# EAGLE board UCirKitBreadboardTop-08231908 (EAGLE 6.5.0), part 1 of 2
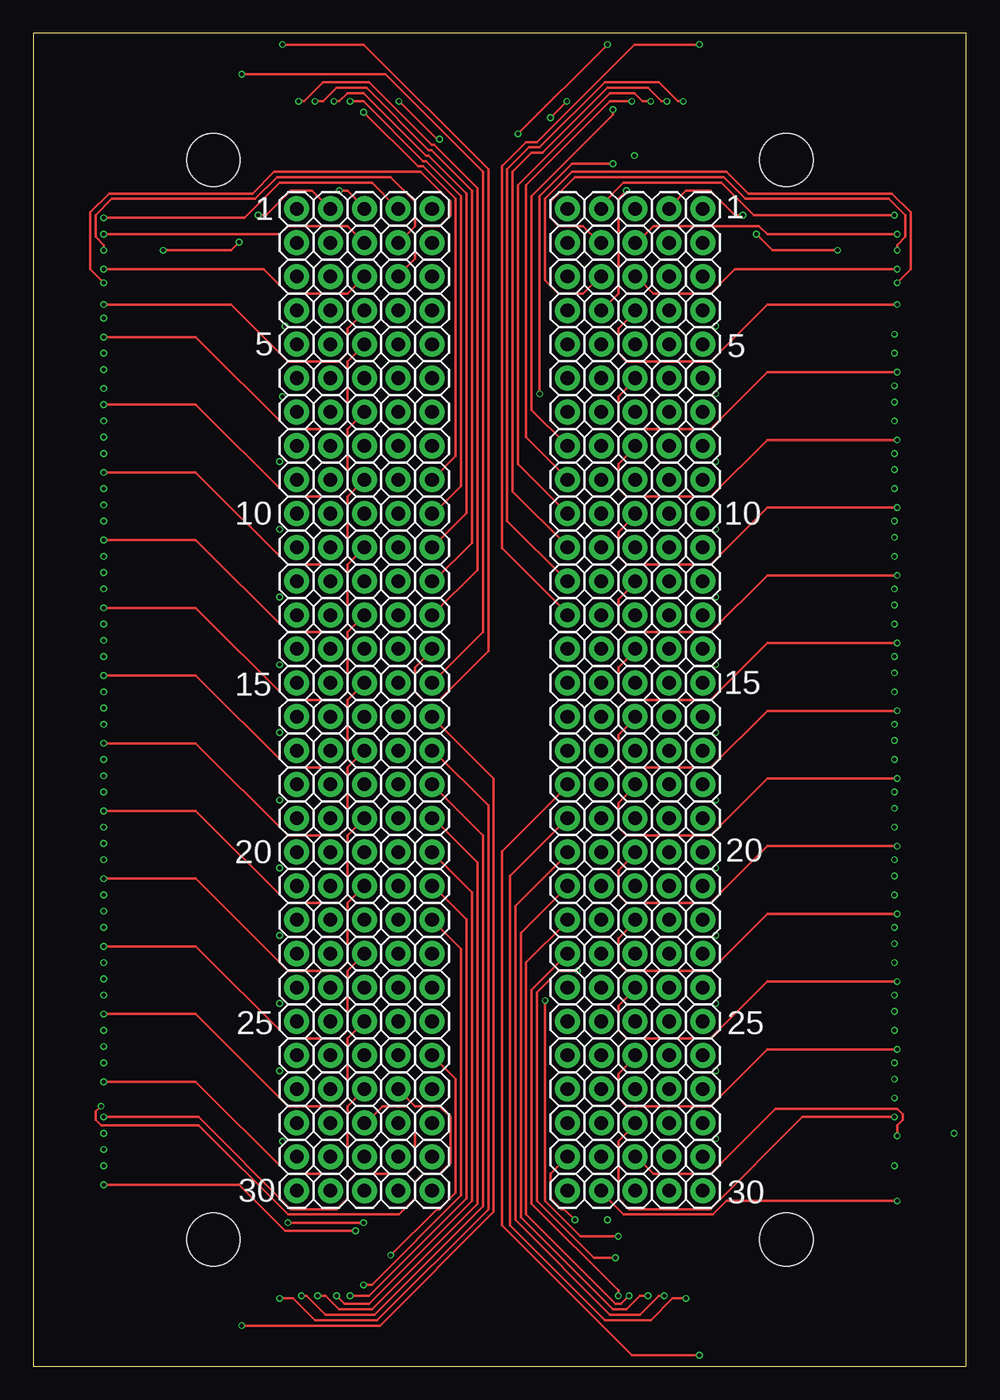
[diagram p2: board, top side]
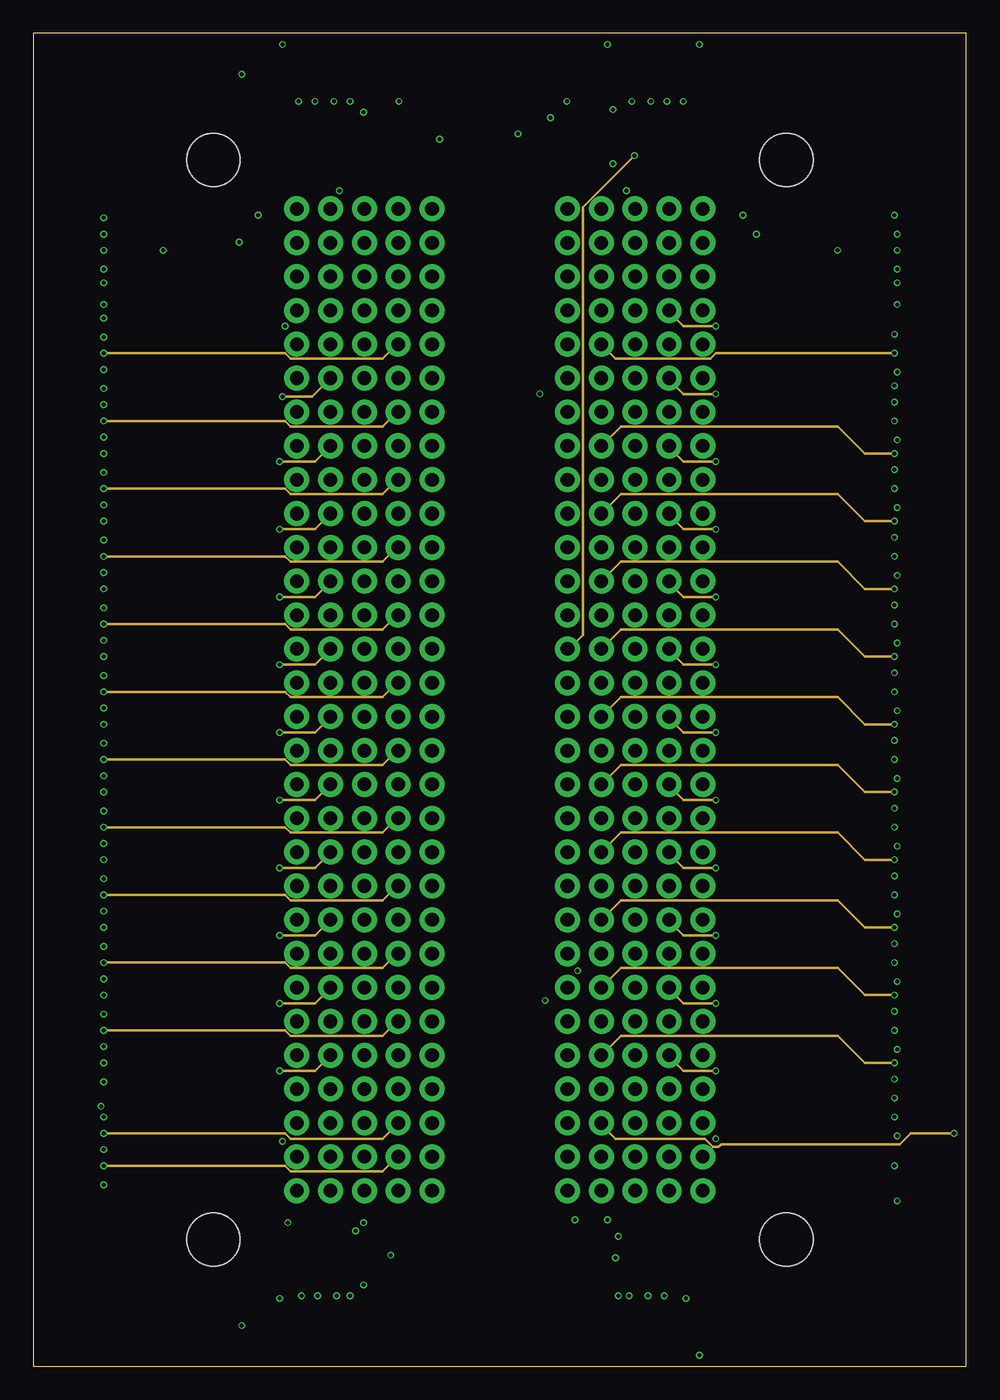
[diagram p3: board, inner layer Route2]
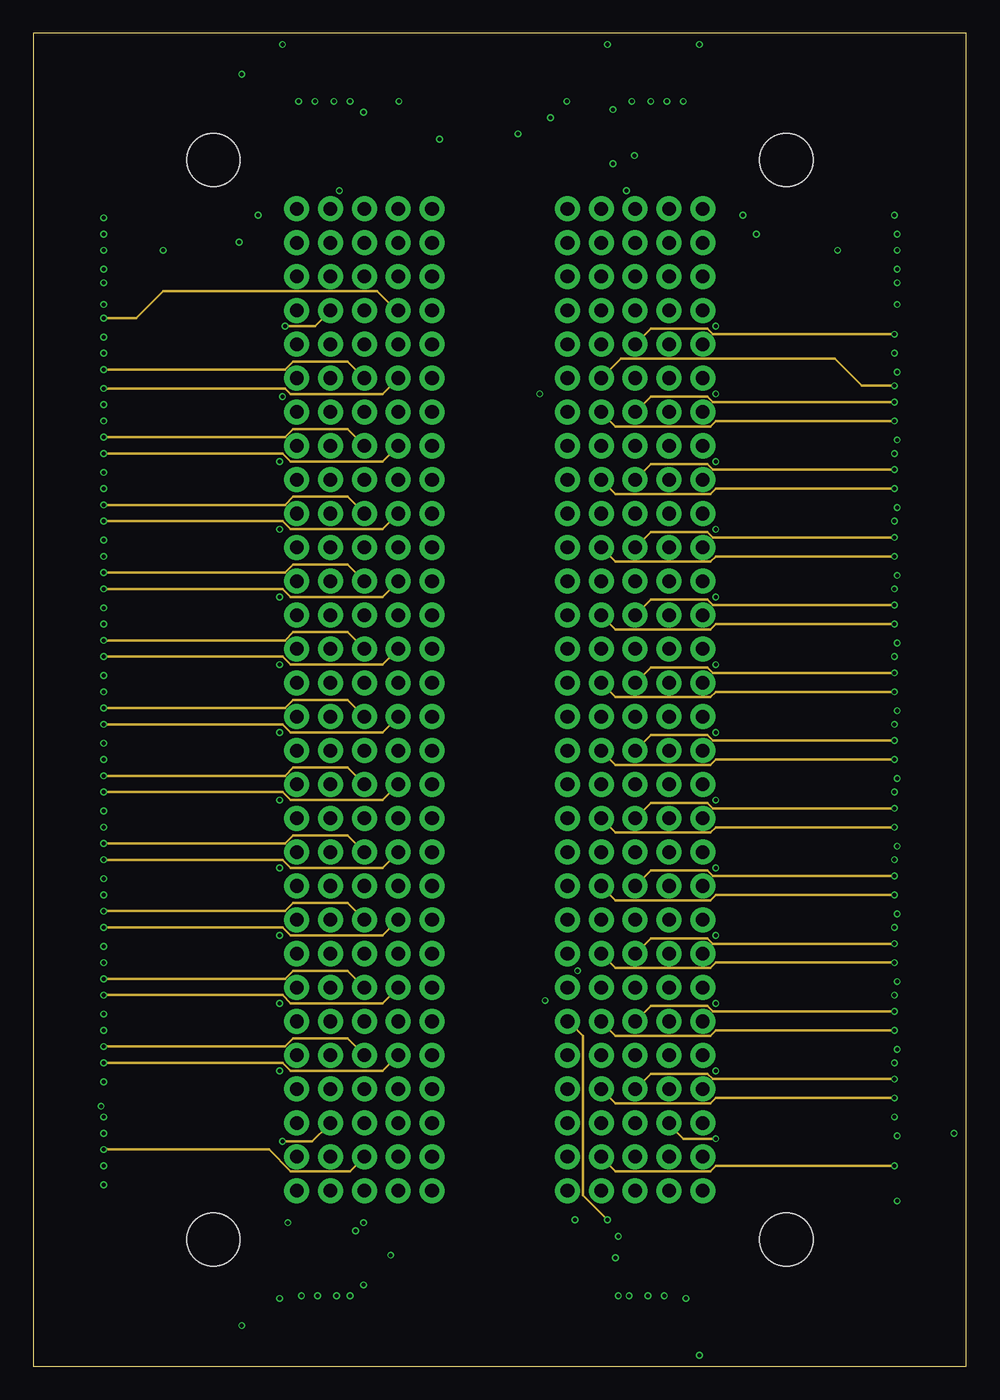
[diagram p4: board, inner layer Route15]
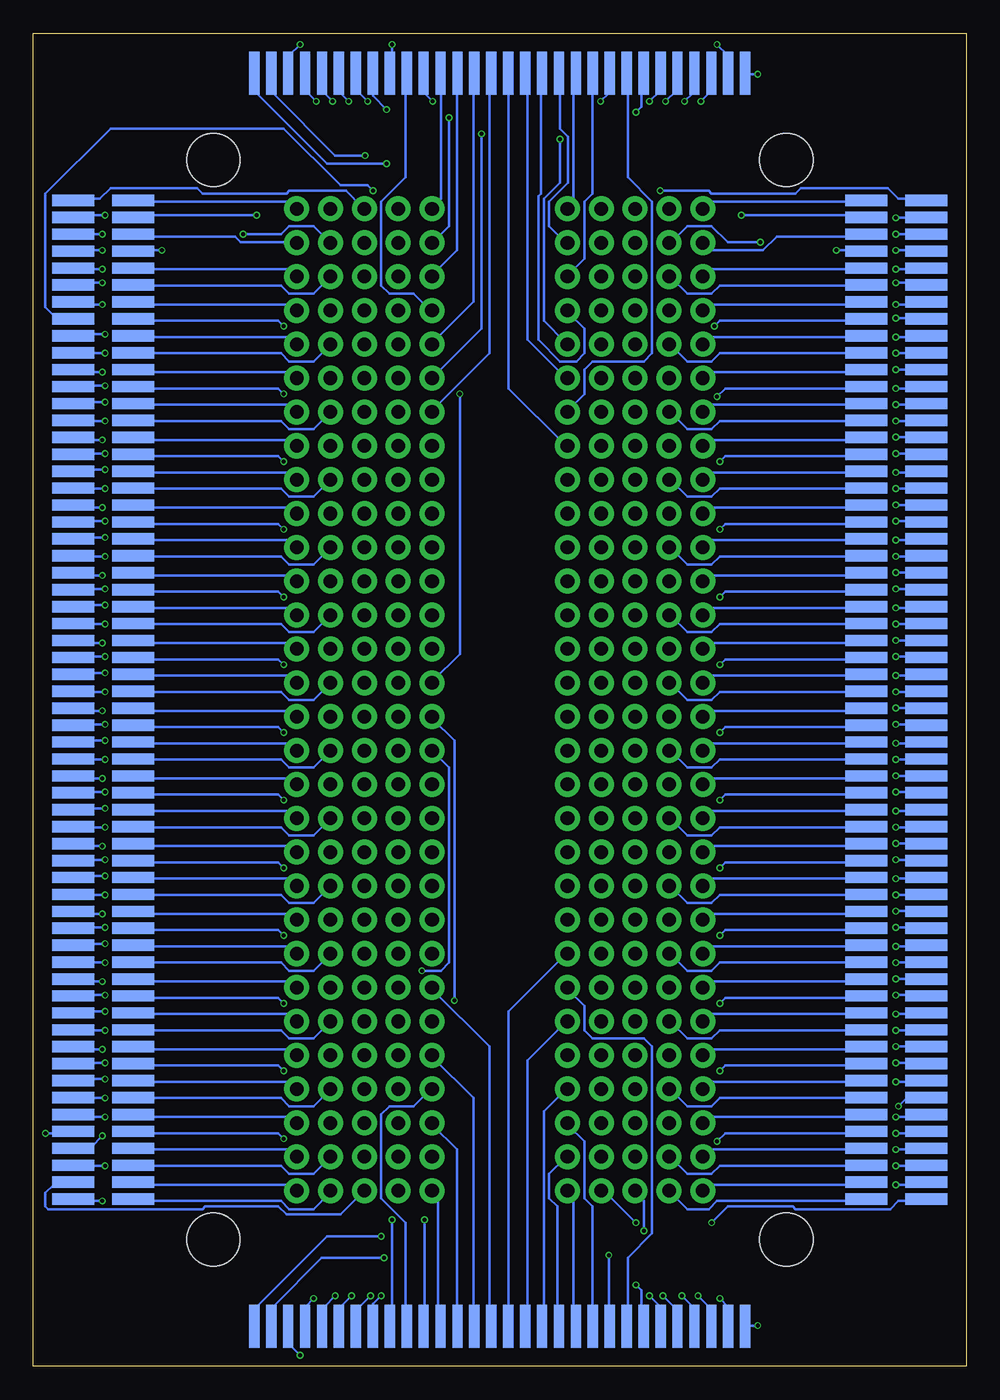
[diagram p5: board, bottom side, seen from below]

Size 70 x 100 mm. Coordinates in mm from the lower left corner, seen from the top.
Outline: 0,0 70,0 70,100 0,100 0,0
Copper layers (1*2*15*16): Top 0.035mm / dielectric 0.2mm / Route2 0.0175mm / dielectric 0.3mm / Route15 0.0175mm / dielectric 0.2mm / Bottom 0.035mm
Design rules "SeeedStudio_4layer_DRU_no_angle_20140221": minimum track width 8mil, minimum drill 12mil, track to track 8mil, track to pad 8mil, pad to pad 8mil, via to via 8mil, smd to smd 0mil, copper to edge 10mil, drill to drill 8mil, minimum pad ring 6mil, minimum via ring 4mil, stop-mask expansion 4mil, vias tented up to drill 100mil, thermal gap 10mil
Holes 4 mm at 13.5,9.5 13.5,90.5 56.5,90.5 56.5,9.5

## Footprints (pad centres in the part's own frame; a part is rotated, then mirrored left to right if it is on the bottom)
1X01_WITHOUT_TEXT = drill 1.016 pad 1.88: 1 0,0
1X01_SMD_3.25X0.85MM_NO_SILK = smd 3.25 x 0.85: P$1 0,0

## Placement (x,y rotation side)
JP1  [1X01_WITHOUT_TEXT]  19.76,86.83 0 top
JP2  [1X01_WITHOUT_TEXT]  22.3,86.83 0 top
JP3  [1X01_WITHOUT_TEXT]  24.84,86.83 0 top
JP4  [1X01_WITHOUT_TEXT]  27.38,86.83 0 top
JP5  [1X01_WITHOUT_TEXT]  29.92,86.83 0 top
JP6  [1X01_WITHOUT_TEXT]  40.08,86.83 0 top
JP7  [1X01_WITHOUT_TEXT]  42.62,86.83 0 top
JP8  [1X01_WITHOUT_TEXT]  45.16,86.83 0 top
JP9  [1X01_WITHOUT_TEXT]  47.7,86.83 0 top
JP10  [1X01_WITHOUT_TEXT]  50.24,86.83 0 top
JP11  [1X01_WITHOUT_TEXT]  19.76,84.29 0 top
JP12  [1X01_WITHOUT_TEXT]  22.3,84.29 0 top
JP13  [1X01_WITHOUT_TEXT]  24.84,84.29 0 top
JP14  [1X01_WITHOUT_TEXT]  27.38,84.29 0 top
JP15  [1X01_WITHOUT_TEXT]  29.92,84.29 0 top
JP16  [1X01_WITHOUT_TEXT]  40.08,84.29 0 top
JP17  [1X01_WITHOUT_TEXT]  42.62,84.29 0 top
JP18  [1X01_WITHOUT_TEXT]  45.16,84.29 0 top
JP19  [1X01_WITHOUT_TEXT]  47.7,84.29 0 top
JP20  [1X01_WITHOUT_TEXT]  50.24,84.29 0 top
JP21  [1X01_WITHOUT_TEXT]  19.76,81.75 0 top
JP22  [1X01_WITHOUT_TEXT]  22.3,81.75 0 top
JP23  [1X01_WITHOUT_TEXT]  24.84,81.75 0 top
JP24  [1X01_WITHOUT_TEXT]  27.38,81.75 0 top
JP25  [1X01_WITHOUT_TEXT]  29.92,81.75 0 top
JP26  [1X01_WITHOUT_TEXT]  40.08,81.75 0 top
JP27  [1X01_WITHOUT_TEXT]  42.62,81.75 0 top
JP28  [1X01_WITHOUT_TEXT]  45.16,81.75 0 top
JP29  [1X01_WITHOUT_TEXT]  47.7,81.75 0 top
JP30  [1X01_WITHOUT_TEXT]  50.24,81.75 0 top
JP31  [1X01_WITHOUT_TEXT]  19.76,79.21 0 top
JP32  [1X01_WITHOUT_TEXT]  22.3,79.21 0 top
JP33  [1X01_WITHOUT_TEXT]  24.84,79.21 0 top
JP34  [1X01_WITHOUT_TEXT]  27.38,79.21 0 top
JP35  [1X01_WITHOUT_TEXT]  29.92,79.21 0 top
JP36  [1X01_WITHOUT_TEXT]  40.08,79.21 0 top
JP37  [1X01_WITHOUT_TEXT]  42.62,79.21 0 top
JP38  [1X01_WITHOUT_TEXT]  45.16,79.21 0 top
JP39  [1X01_WITHOUT_TEXT]  47.7,79.21 0 top
JP40  [1X01_WITHOUT_TEXT]  50.24,79.21 0 top
JP41  [1X01_WITHOUT_TEXT]  19.76,76.67 0 top
JP42  [1X01_WITHOUT_TEXT]  22.3,76.67 0 top
JP43  [1X01_WITHOUT_TEXT]  24.84,76.67 0 top
JP44  [1X01_WITHOUT_TEXT]  27.38,76.67 0 top
JP45  [1X01_WITHOUT_TEXT]  29.92,76.67 0 top
JP46  [1X01_WITHOUT_TEXT]  40.08,76.67 0 top
JP47  [1X01_WITHOUT_TEXT]  42.62,76.67 0 top
JP48  [1X01_WITHOUT_TEXT]  45.16,76.67 0 top
JP49  [1X01_WITHOUT_TEXT]  47.7,76.67 0 top
JP50  [1X01_WITHOUT_TEXT]  50.24,76.67 0 top
JP51  [1X01_WITHOUT_TEXT]  19.76,74.13 0 top
JP52  [1X01_WITHOUT_TEXT]  22.3,74.13 0 top
JP53  [1X01_WITHOUT_TEXT]  24.84,74.13 0 top
JP54  [1X01_WITHOUT_TEXT]  27.38,74.13 0 top
JP55  [1X01_WITHOUT_TEXT]  29.92,74.13 0 top
JP56  [1X01_WITHOUT_TEXT]  40.08,74.13 0 top
JP57  [1X01_WITHOUT_TEXT]  42.62,74.13 0 top
JP58  [1X01_WITHOUT_TEXT]  45.16,74.13 0 top
JP59  [1X01_WITHOUT_TEXT]  47.7,74.13 0 top
JP60  [1X01_WITHOUT_TEXT]  50.24,74.13 0 top
JP61  [1X01_WITHOUT_TEXT]  19.76,71.59 0 top
JP62  [1X01_WITHOUT_TEXT]  22.3,71.59 0 top
JP63  [1X01_WITHOUT_TEXT]  24.84,71.59 0 top
JP64  [1X01_WITHOUT_TEXT]  27.38,71.59 0 top
JP65  [1X01_WITHOUT_TEXT]  29.92,71.59 0 top
JP66  [1X01_WITHOUT_TEXT]  40.08,71.59 0 top
JP67  [1X01_WITHOUT_TEXT]  42.62,71.59 0 top
JP68  [1X01_WITHOUT_TEXT]  45.16,71.59 0 top
JP69  [1X01_WITHOUT_TEXT]  47.7,71.59 0 top
JP70  [1X01_WITHOUT_TEXT]  50.24,71.59 0 top
JP71  [1X01_WITHOUT_TEXT]  19.76,69.05 0 top
JP72  [1X01_WITHOUT_TEXT]  22.3,69.05 0 top
JP73  [1X01_WITHOUT_TEXT]  24.84,69.05 0 top
JP74  [1X01_WITHOUT_TEXT]  27.38,69.05 0 top
JP75  [1X01_WITHOUT_TEXT]  29.92,69.05 0 top
JP76  [1X01_WITHOUT_TEXT]  40.08,69.05 0 top
JP77  [1X01_WITHOUT_TEXT]  42.62,69.05 0 top
JP78  [1X01_WITHOUT_TEXT]  45.16,69.05 0 top
JP79  [1X01_WITHOUT_TEXT]  47.7,69.05 0 top
JP80  [1X01_WITHOUT_TEXT]  50.24,69.05 0 top
JP81  [1X01_WITHOUT_TEXT]  19.76,66.51 0 top
JP82  [1X01_WITHOUT_TEXT]  22.3,66.51 0 top
JP83  [1X01_WITHOUT_TEXT]  24.84,66.51 0 top
JP84  [1X01_WITHOUT_TEXT]  27.38,66.51 0 top
JP85  [1X01_WITHOUT_TEXT]  29.92,66.51 0 top
JP86  [1X01_WITHOUT_TEXT]  40.08,66.51 0 top
JP87  [1X01_WITHOUT_TEXT]  42.62,66.51 0 top
JP88  [1X01_WITHOUT_TEXT]  45.16,66.51 0 top
JP89  [1X01_WITHOUT_TEXT]  47.7,66.51 0 top
JP90  [1X01_WITHOUT_TEXT]  50.24,66.51 0 top
JP91  [1X01_WITHOUT_TEXT]  19.76,63.97 0 top
JP92  [1X01_WITHOUT_TEXT]  22.3,63.97 0 top
JP93  [1X01_WITHOUT_TEXT]  24.84,63.97 0 top
JP94  [1X01_WITHOUT_TEXT]  27.38,63.97 0 top
JP95  [1X01_WITHOUT_TEXT]  29.92,63.97 0 top
JP96  [1X01_WITHOUT_TEXT]  40.08,63.97 0 top
JP97  [1X01_WITHOUT_TEXT]  42.62,63.97 0 top
JP98  [1X01_WITHOUT_TEXT]  45.16,63.97 0 top
JP99  [1X01_WITHOUT_TEXT]  47.7,63.97 0 top
JP100  [1X01_WITHOUT_TEXT]  50.24,63.97 0 top
JP101  [1X01_WITHOUT_TEXT]  19.76,61.43 0 top
JP102  [1X01_WITHOUT_TEXT]  22.3,61.43 0 top
JP103  [1X01_WITHOUT_TEXT]  24.84,61.43 0 top
JP104  [1X01_WITHOUT_TEXT]  27.38,61.43 0 top
JP105  [1X01_WITHOUT_TEXT]  29.92,61.43 0 top
JP106  [1X01_WITHOUT_TEXT]  40.08,61.43 0 top
JP107  [1X01_WITHOUT_TEXT]  42.62,61.43 0 top
JP108  [1X01_WITHOUT_TEXT]  45.16,61.43 0 top
JP109  [1X01_WITHOUT_TEXT]  47.7,61.43 0 top
JP110  [1X01_WITHOUT_TEXT]  50.24,61.43 0 top
JP111  [1X01_WITHOUT_TEXT]  19.76,58.89 0 top
JP112  [1X01_WITHOUT_TEXT]  22.3,58.89 0 top
JP113  [1X01_WITHOUT_TEXT]  24.84,58.89 0 top
JP114  [1X01_WITHOUT_TEXT]  27.38,58.89 0 top
JP115  [1X01_WITHOUT_TEXT]  29.92,58.89 0 top
JP116  [1X01_WITHOUT_TEXT]  40.08,58.89 0 top
JP117  [1X01_WITHOUT_TEXT]  42.62,58.89 0 top
JP118  [1X01_WITHOUT_TEXT]  45.16,58.89 0 top
JP119  [1X01_WITHOUT_TEXT]  47.7,58.89 0 top
JP120  [1X01_WITHOUT_TEXT]  50.24,58.89 0 top
JP121  [1X01_WITHOUT_TEXT]  19.76,56.35 0 top
JP122  [1X01_WITHOUT_TEXT]  22.3,56.35 0 top
JP123  [1X01_WITHOUT_TEXT]  24.84,56.35 0 top
JP124  [1X01_WITHOUT_TEXT]  27.38,56.35 0 top
JP125  [1X01_WITHOUT_TEXT]  29.92,56.35 0 top
JP126  [1X01_WITHOUT_TEXT]  40.08,56.35 0 top
JP127  [1X01_WITHOUT_TEXT]  42.62,56.35 0 top
JP128  [1X01_WITHOUT_TEXT]  45.16,56.35 0 top
JP129  [1X01_WITHOUT_TEXT]  47.7,56.35 0 top
JP130  [1X01_WITHOUT_TEXT]  50.24,56.35 0 top
JP131  [1X01_WITHOUT_TEXT]  19.76,53.81 0 top
JP132  [1X01_WITHOUT_TEXT]  22.3,53.81 0 top
JP133  [1X01_WITHOUT_TEXT]  24.84,53.81 0 top
JP134  [1X01_WITHOUT_TEXT]  27.38,53.81 0 top
JP135  [1X01_WITHOUT_TEXT]  29.92,53.81 0 top
JP136  [1X01_WITHOUT_TEXT]  40.08,53.81 0 top
JP137  [1X01_WITHOUT_TEXT]  42.62,53.81 0 top
JP138  [1X01_WITHOUT_TEXT]  45.16,53.81 0 top
JP139  [1X01_WITHOUT_TEXT]  47.7,53.81 0 top
JP140  [1X01_WITHOUT_TEXT]  50.24,53.81 0 top
JP141  [1X01_WITHOUT_TEXT]  19.76,51.27 0 top
JP142  [1X01_WITHOUT_TEXT]  22.3,51.27 0 top
JP143  [1X01_WITHOUT_TEXT]  24.84,51.27 0 top
JP144  [1X01_WITHOUT_TEXT]  27.38,51.27 0 top
JP145  [1X01_WITHOUT_TEXT]  29.92,51.27 0 top
JP146  [1X01_WITHOUT_TEXT]  40.08,51.27 0 top
JP147  [1X01_WITHOUT_TEXT]  42.62,51.27 0 top
JP148  [1X01_WITHOUT_TEXT]  45.16,51.27 0 top
JP149  [1X01_WITHOUT_TEXT]  47.7,51.27 0 top
JP150  [1X01_WITHOUT_TEXT]  50.24,51.27 0 top
JP151  [1X01_WITHOUT_TEXT]  19.76,48.73 0 top
JP152  [1X01_WITHOUT_TEXT]  22.3,48.73 0 top
JP153  [1X01_WITHOUT_TEXT]  24.84,48.73 0 top
JP154  [1X01_WITHOUT_TEXT]  27.38,48.73 0 top
JP155  [1X01_WITHOUT_TEXT]  29.92,48.73 0 top
JP156  [1X01_WITHOUT_TEXT]  40.08,48.73 0 top
JP157  [1X01_WITHOUT_TEXT]  42.62,48.73 0 top
JP158  [1X01_WITHOUT_TEXT]  45.16,48.73 0 top
JP159  [1X01_WITHOUT_TEXT]  47.7,48.73 0 top
JP160  [1X01_WITHOUT_TEXT]  50.24,48.73 0 top
JP161  [1X01_WITHOUT_TEXT]  19.76,46.19 0 top
JP162  [1X01_WITHOUT_TEXT]  22.3,46.19 0 top
JP163  [1X01_WITHOUT_TEXT]  24.84,46.19 0 top
JP164  [1X01_WITHOUT_TEXT]  27.38,46.19 0 top
JP165  [1X01_WITHOUT_TEXT]  29.92,46.19 0 top
JP166  [1X01_WITHOUT_TEXT]  40.08,46.19 0 top
JP167  [1X01_WITHOUT_TEXT]  42.62,46.19 0 top
JP168  [1X01_WITHOUT_TEXT]  45.16,46.19 0 top
JP169  [1X01_WITHOUT_TEXT]  47.7,46.19 0 top
JP170  [1X01_WITHOUT_TEXT]  50.24,46.19 0 top
JP171  [1X01_WITHOUT_TEXT]  19.76,43.65 0 top
JP172  [1X01_WITHOUT_TEXT]  22.3,43.65 0 top
JP173  [1X01_WITHOUT_TEXT]  24.84,43.65 0 top
JP174  [1X01_WITHOUT_TEXT]  27.38,43.65 0 top
JP175  [1X01_WITHOUT_TEXT]  29.92,43.65 0 top
JP176  [1X01_WITHOUT_TEXT]  40.08,43.65 0 top
JP177  [1X01_WITHOUT_TEXT]  42.62,43.65 0 top
JP178  [1X01_WITHOUT_TEXT]  45.16,43.65 0 top
JP179  [1X01_WITHOUT_TEXT]  47.7,43.65 0 top
JP180  [1X01_WITHOUT_TEXT]  50.24,43.65 0 top
JP181  [1X01_WITHOUT_TEXT]  19.76,41.11 0 top
JP182  [1X01_WITHOUT_TEXT]  22.3,41.11 0 top
JP183  [1X01_WITHOUT_TEXT]  24.84,41.11 0 top
JP184  [1X01_WITHOUT_TEXT]  27.38,41.11 0 top
JP185  [1X01_WITHOUT_TEXT]  29.92,41.11 0 top
JP186  [1X01_WITHOUT_TEXT]  40.08,41.11 0 top
JP187  [1X01_WITHOUT_TEXT]  42.62,41.11 0 top
JP188  [1X01_WITHOUT_TEXT]  45.16,41.11 0 top
JP189  [1X01_WITHOUT_TEXT]  47.7,41.11 0 top
JP190  [1X01_WITHOUT_TEXT]  50.24,41.11 0 top
JP191  [1X01_WITHOUT_TEXT]  19.76,38.57 0 top
JP192  [1X01_WITHOUT_TEXT]  22.3,38.57 0 top
JP193  [1X01_WITHOUT_TEXT]  24.84,38.57 0 top
JP194  [1X01_WITHOUT_TEXT]  27.38,38.57 0 top
JP195  [1X01_WITHOUT_TEXT]  29.92,38.57 0 top
JP196  [1X01_WITHOUT_TEXT]  40.08,38.57 0 top
JP197  [1X01_WITHOUT_TEXT]  42.62,38.57 0 top
JP198  [1X01_WITHOUT_TEXT]  45.16,38.57 0 top
JP199  [1X01_WITHOUT_TEXT]  47.7,38.57 0 top
JP200  [1X01_WITHOUT_TEXT]  50.24,38.57 0 top
JP201  [1X01_WITHOUT_TEXT]  19.76,36.03 0 top
JP202  [1X01_WITHOUT_TEXT]  22.3,36.03 0 top
JP203  [1X01_WITHOUT_TEXT]  24.84,36.03 0 top
JP204  [1X01_WITHOUT_TEXT]  27.38,36.03 0 top
JP205  [1X01_WITHOUT_TEXT]  29.92,36.03 0 top
JP206  [1X01_WITHOUT_TEXT]  40.08,36.03 0 top
JP207  [1X01_WITHOUT_TEXT]  42.62,36.03 0 top
JP208  [1X01_WITHOUT_TEXT]  45.16,36.03 0 top
JP209  [1X01_WITHOUT_TEXT]  47.7,36.03 0 top
JP210  [1X01_WITHOUT_TEXT]  50.24,36.03 0 top
JP211  [1X01_WITHOUT_TEXT]  19.76,33.49 0 top
JP212  [1X01_WITHOUT_TEXT]  22.3,33.49 0 top
JP213  [1X01_WITHOUT_TEXT]  24.84,33.49 0 top
JP214  [1X01_WITHOUT_TEXT]  27.38,33.49 0 top
JP215  [1X01_WITHOUT_TEXT]  29.92,33.49 0 top
JP216  [1X01_WITHOUT_TEXT]  40.08,33.49 0 top
JP217  [1X01_WITHOUT_TEXT]  42.62,33.49 0 top
JP218  [1X01_WITHOUT_TEXT]  45.16,33.49 0 top
JP219  [1X01_WITHOUT_TEXT]  47.7,33.49 0 top
JP220  [1X01_WITHOUT_TEXT]  50.24,33.49 0 top
JP221  [1X01_WITHOUT_TEXT]  19.76,30.95 0 top
JP222  [1X01_WITHOUT_TEXT]  22.3,30.95 0 top
JP223  [1X01_WITHOUT_TEXT]  24.84,30.95 0 top
JP224  [1X01_WITHOUT_TEXT]  27.38,30.95 0 top
JP225  [1X01_WITHOUT_TEXT]  29.92,30.95 0 top
JP226  [1X01_WITHOUT_TEXT]  40.08,30.95 0 top
JP227  [1X01_WITHOUT_TEXT]  42.62,30.95 0 top
JP228  [1X01_WITHOUT_TEXT]  45.16,30.95 0 top
JP229  [1X01_WITHOUT_TEXT]  47.7,30.95 0 top
JP230  [1X01_WITHOUT_TEXT]  50.24,30.95 0 top
JP231  [1X01_WITHOUT_TEXT]  19.76,28.41 0 top
JP232  [1X01_WITHOUT_TEXT]  22.3,28.41 0 top
JP233  [1X01_WITHOUT_TEXT]  24.84,28.41 0 top
JP234  [1X01_WITHOUT_TEXT]  27.38,28.41 0 top
JP235  [1X01_WITHOUT_TEXT]  29.92,28.41 0 top
JP236  [1X01_WITHOUT_TEXT]  40.08,28.41 0 top
JP237  [1X01_WITHOUT_TEXT]  42.62,28.41 0 top
JP238  [1X01_WITHOUT_TEXT]  45.16,28.41 0 top
JP239  [1X01_WITHOUT_TEXT]  47.7,28.41 0 top
JP240  [1X01_WITHOUT_TEXT]  50.24,28.41 0 top
JP241  [1X01_WITHOUT_TEXT]  19.76,25.87 0 top
JP242  [1X01_WITHOUT_TEXT]  22.3,25.87 0 top
JP243  [1X01_WITHOUT_TEXT]  24.84,25.87 0 top
JP244  [1X01_WITHOUT_TEXT]  27.38,25.87 0 top
JP245  [1X01_WITHOUT_TEXT]  29.92,25.87 0 top
JP246  [1X01_WITHOUT_TEXT]  40.08,25.87 0 top
JP247  [1X01_WITHOUT_TEXT]  42.62,25.87 0 top
JP248  [1X01_WITHOUT_TEXT]  45.16,25.87 0 top
JP249  [1X01_WITHOUT_TEXT]  47.7,25.87 0 top
JP250  [1X01_WITHOUT_TEXT]  50.24,25.87 0 top
JP251  [1X01_WITHOUT_TEXT]  19.76,23.33 0 top
JP252  [1X01_WITHOUT_TEXT]  22.3,23.33 0 top
JP253  [1X01_WITHOUT_TEXT]  24.84,23.33 0 top
JP254  [1X01_WITHOUT_TEXT]  27.38,23.33 0 top
JP255  [1X01_WITHOUT_TEXT]  29.92,23.33 0 top
JP256  [1X01_WITHOUT_TEXT]  40.08,23.33 0 top
JP257  [1X01_WITHOUT_TEXT]  42.62,23.33 0 top
JP258  [1X01_WITHOUT_TEXT]  45.16,23.33 0 top
JP259  [1X01_WITHOUT_TEXT]  47.7,23.33 0 top
JP260  [1X01_WITHOUT_TEXT]  50.24,23.33 0 top
JP261  [1X01_WITHOUT_TEXT]  19.76,20.79 0 top
JP262  [1X01_WITHOUT_TEXT]  22.3,20.79 0 top
JP263  [1X01_WITHOUT_TEXT]  24.84,20.79 0 top
JP264  [1X01_WITHOUT_TEXT]  27.38,20.79 0 top
JP265  [1X01_WITHOUT_TEXT]  29.92,20.79 0 top
JP266  [1X01_WITHOUT_TEXT]  40.08,20.79 0 top
JP267  [1X01_WITHOUT_TEXT]  42.62,20.79 0 top
JP268  [1X01_WITHOUT_TEXT]  45.16,20.79 0 top
JP269  [1X01_WITHOUT_TEXT]  47.7,20.79 0 top
JP270  [1X01_WITHOUT_TEXT]  50.24,20.79 0 top
JP271  [1X01_WITHOUT_TEXT]  19.76,18.25 0 top
JP272  [1X01_WITHOUT_TEXT]  22.3,18.25 0 top
JP273  [1X01_WITHOUT_TEXT]  24.84,18.25 0 top
JP274  [1X01_WITHOUT_TEXT]  27.38,18.25 0 top
JP275  [1X01_WITHOUT_TEXT]  29.92,18.25 0 top
JP276  [1X01_WITHOUT_TEXT]  40.08,18.25 0 top
JP277  [1X01_WITHOUT_TEXT]  42.62,18.25 0 top
JP278  [1X01_WITHOUT_TEXT]  45.16,18.25 0 top
JP279  [1X01_WITHOUT_TEXT]  47.7,18.25 0 top
JP280  [1X01_WITHOUT_TEXT]  50.24,18.25 0 top
JP281  [1X01_WITHOUT_TEXT]  19.76,15.71 0 top
JP282  [1X01_WITHOUT_TEXT]  22.3,15.71 0 top
JP283  [1X01_WITHOUT_TEXT]  24.84,15.71 0 top
JP284  [1X01_WITHOUT_TEXT]  27.38,15.71 0 top
JP285  [1X01_WITHOUT_TEXT]  29.92,15.71 0 top
JP286  [1X01_WITHOUT_TEXT]  40.08,15.71 0 top
JP287  [1X01_WITHOUT_TEXT]  42.62,15.71 0 top
JP288  [1X01_WITHOUT_TEXT]  45.16,15.71 0 top
JP289  [1X01_WITHOUT_TEXT]  47.7,15.71 0 top
JP290  [1X01_WITHOUT_TEXT]  50.24,15.71 0 top
JP291  [1X01_WITHOUT_TEXT]  19.76,13.17 0 top
JP292  [1X01_WITHOUT_TEXT]  22.3,13.17 0 top
JP293  [1X01_WITHOUT_TEXT]  24.84,13.17 0 top
JP294  [1X01_WITHOUT_TEXT]  27.38,13.17 0 top
JP295  [1X01_WITHOUT_TEXT]  29.92,13.17 0 top
JP296  [1X01_WITHOUT_TEXT]  40.08,13.17 0 top
JP297  [1X01_WITHOUT_TEXT]  42.62,13.17 0 top
JP298  [1X01_WITHOUT_TEXT]  45.16,13.17 0 top
JP299  [1X01_WITHOUT_TEXT]  47.7,13.17 0 top
JP300  [1X01_WITHOUT_TEXT]  50.24,13.17 0 top
JP901  [1X01_SMD_3.25X0.85MM_NO_SILK]  3,87.47 0 bottom
JP902  [1X01_SMD_3.25X0.85MM_NO_SILK]  3,86.19 0 bottom
JP903  [1X01_SMD_3.25X0.85MM_NO_SILK]  3,84.92 0 bottom
JP904  [1X01_SMD_3.25X0.85MM_NO_SILK]  3,83.66 0 bottom
JP905  [1X01_SMD_3.25X0.85MM_NO_SILK]  3,82.39 0 bottom
JP906  [1X01_SMD_3.25X0.85MM_NO_SILK]  3,81.11 0 bottom
JP907  [1X01_SMD_3.25X0.85MM_NO_SILK]  3,79.84 0 bottom
JP908  [1X01_SMD_3.25X0.85MM_NO_SILK]  3,78.58 0 bottom
JP909  [1X01_SMD_3.25X0.85MM_NO_SILK]  3,77.31 0 bottom
JP910  [1X01_SMD_3.25X0.85MM_NO_SILK]  3,76.03 0 bottom
JP911  [1X01_SMD_3.25X0.85MM_NO_SILK]  3,74.77 0 bottom
JP912  [1X01_SMD_3.25X0.85MM_NO_SILK]  3,73.5 0 bottom
JP913  [1X01_SMD_3.25X0.85MM_NO_SILK]  3,72.22 0 bottom
JP914  [1X01_SMD_3.25X0.85MM_NO_SILK]  3,70.95 0 bottom
JP915  [1X01_SMD_3.25X0.85MM_NO_SILK]  3,69.69 0 bottom
JP916  [1X01_SMD_3.25X0.85MM_NO_SILK]  3,68.42 0 bottom
JP917  [1X01_SMD_3.25X0.85MM_NO_SILK]  3,67.14 0 bottom
JP918  [1X01_SMD_3.25X0.85MM_NO_SILK]  3,65.88 0 bottom
JP919  [1X01_SMD_3.25X0.85MM_NO_SILK]  3,64.61 0 bottom
JP920  [1X01_SMD_3.25X0.85MM_NO_SILK]  3,63.34 0 bottom
JP921  [1X01_SMD_3.25X0.85MM_NO_SILK]  3,62.06 0 bottom
JP922  [1X01_SMD_3.25X0.85MM_NO_SILK]  3,60.8 0 bottom
JP923  [1X01_SMD_3.25X0.85MM_NO_SILK]  3,59.52 0 bottom
JP924  [1X01_SMD_3.25X0.85MM_NO_SILK]  3,58.26 0 bottom
JP925  [1X01_SMD_3.25X0.85MM_NO_SILK]  3,56.98 0 bottom
JP926  [1X01_SMD_3.25X0.85MM_NO_SILK]  3,55.72 0 bottom
JP927  [1X01_SMD_3.25X0.85MM_NO_SILK]  3,54.45 0 bottom
JP928  [1X01_SMD_3.25X0.85MM_NO_SILK]  3,53.17 0 bottom
JP929  [1X01_SMD_3.25X0.85MM_NO_SILK]  3,51.91 0 bottom
JP930  [1X01_SMD_3.25X0.85MM_NO_SILK]  3,50.63 0 bottom
JP931  [1X01_SMD_3.25X0.85MM_NO_SILK]  3,49.37 0 bottom
JP932  [1X01_SMD_3.25X0.85MM_NO_SILK]  3,48.09 0 bottom
JP933  [1X01_SMD_3.25X0.85MM_NO_SILK]  3,46.83 0 bottom
JP934  [1X01_SMD_3.25X0.85MM_NO_SILK]  3,45.55 0 bottom
JP935  [1X01_SMD_3.25X0.85MM_NO_SILK]  3,44.28 0 bottom
JP936  [1X01_SMD_3.25X0.85MM_NO_SILK]  3,43.02 0 bottom
JP937  [1X01_SMD_3.25X0.85MM_NO_SILK]  3,41.74 0 bottom
JP938  [1X01_SMD_3.25X0.85MM_NO_SILK]  3,40.48 0 bottom
JP939  [1X01_SMD_3.25X0.85MM_NO_SILK]  3,39.2 0 bottom
JP940  [1X01_SMD_3.25X0.85MM_NO_SILK]  3,37.94 0 bottom
JP941  [1X01_SMD_3.25X0.85MM_NO_SILK]  3,36.66 0 bottom
JP942  [1X01_SMD_3.25X0.85MM_NO_SILK]  3,35.4 0 bottom
JP943  [1X01_SMD_3.25X0.85MM_NO_SILK]  3,34.12 0 bottom
JP944  [1X01_SMD_3.25X0.85MM_NO_SILK]  3,32.85 0 bottom
JP945  [1X01_SMD_3.25X0.85MM_NO_SILK]  3,31.59 0 bottom
JP946  [1X01_SMD_3.25X0.85MM_NO_SILK]  3,30.32 0 bottom
JP947  [1X01_SMD_3.25X0.85MM_NO_SILK]  3,29.05 0 bottom
JP948  [1X01_SMD_3.25X0.85MM_NO_SILK]  3,27.77 0 bottom
JP949  [1X01_SMD_3.25X0.85MM_NO_SILK]  3,26.5 0 bottom
JP950  [1X01_SMD_3.25X0.85MM_NO_SILK]  3,25.23 0 bottom
JP951  [1X01_SMD_3.25X0.85MM_NO_SILK]  3,23.96 0 bottom
JP952  [1X01_SMD_3.25X0.85MM_NO_SILK]  3,22.7 0 bottom
JP953  [1X01_SMD_3.25X0.85MM_NO_SILK]  3,21.43 0 bottom
JP954  [1X01_SMD_3.25X0.85MM_NO_SILK]  3,20.16 0 bottom
JP955  [1X01_SMD_3.25X0.85MM_NO_SILK]  3,18.89 0 bottom
JP956  [1X01_SMD_3.25X0.85MM_NO_SILK]  3,17.61 0 bottom
JP957  [1X01_SMD_3.25X0.85MM_NO_SILK]  3,16.34 0 bottom
JP958  [1X01_SMD_3.25X0.85MM_NO_SILK]  3,15.07 0 bottom
JP959  [1X01_SMD_3.25X0.85MM_NO_SILK]  3,13.8 0 bottom
JP960  [1X01_SMD_3.25X0.85MM_NO_SILK]  3,12.54 0 bottom
JP961  [1X01_SMD_3.25X0.85MM_NO_SILK]  7.5,87.47 0 bottom
JP962  [1X01_SMD_3.25X0.85MM_NO_SILK]  7.5,86.19 0 bottom
JP963  [1X01_SMD_3.25X0.85MM_NO_SILK]  7.5,84.92 0 bottom
JP964  [1X01_SMD_3.25X0.85MM_NO_SILK]  7.5,83.66 0 bottom
JP965  [1X01_SMD_3.25X0.85MM_NO_SILK]  7.5,82.39 0 bottom
JP966  [1X01_SMD_3.25X0.85MM_NO_SILK]  7.5,81.11 0 bottom
JP967  [1X01_SMD_3.25X0.85MM_NO_SILK]  7.5,79.84 0 bottom
JP968  [1X01_SMD_3.25X0.85MM_NO_SILK]  7.5,78.58 0 bottom
JP969  [1X01_SMD_3.25X0.85MM_NO_SILK]  7.5,77.31 0 bottom
JP970  [1X01_SMD_3.25X0.85MM_NO_SILK]  7.5,76.03 0 bottom
JP971  [1X01_SMD_3.25X0.85MM_NO_SILK]  7.5,74.77 0 bottom
JP972  [1X01_SMD_3.25X0.85MM_NO_SILK]  7.5,73.5 0 bottom
JP973  [1X01_SMD_3.25X0.85MM_NO_SILK]  7.5,72.22 0 bottom
JP974  [1X01_SMD_3.25X0.85MM_NO_SILK]  7.5,70.95 0 bottom
JP975  [1X01_SMD_3.25X0.85MM_NO_SILK]  7.5,69.69 0 bottom
JP976  [1X01_SMD_3.25X0.85MM_NO_SILK]  7.5,68.42 0 bottom
JP977  [1X01_SMD_3.25X0.85MM_NO_SILK]  7.5,67.14 0 bottom
JP978  [1X01_SMD_3.25X0.85MM_NO_SILK]  7.5,65.88 0 bottom
JP979  [1X01_SMD_3.25X0.85MM_NO_SILK]  7.5,64.61 0 bottom
JP980  [1X01_SMD_3.25X0.85MM_NO_SILK]  7.5,63.34 0 bottom
JP981  [1X01_SMD_3.25X0.85MM_NO_SILK]  7.5,62.06 0 bottom
JP982  [1X01_SMD_3.25X0.85MM_NO_SILK]  7.5,60.8 0 bottom
JP983  [1X01_SMD_3.25X0.85MM_NO_SILK]  7.5,59.52 0 bottom
JP984  [1X01_SMD_3.25X0.85MM_NO_SILK]  7.5,58.26 0 bottom
JP985  [1X01_SMD_3.25X0.85MM_NO_SILK]  7.5,56.98 0 bottom
JP986  [1X01_SMD_3.25X0.85MM_NO_SILK]  7.5,55.72 0 bottom
JP987  [1X01_SMD_3.25X0.85MM_NO_SILK]  7.5,54.45 0 bottom
JP988  [1X01_SMD_3.25X0.85MM_NO_SILK]  7.5,53.17 0 bottom
JP989  [1X01_SMD_3.25X0.85MM_NO_SILK]  7.5,51.91 0 bottom
JP990  [1X01_SMD_3.25X0.85MM_NO_SILK]  7.5,50.63 0 bottom
JP991  [1X01_SMD_3.25X0.85MM_NO_SILK]  7.5,49.37 0 bottom
JP992  [1X01_SMD_3.25X0.85MM_NO_SILK]  7.5,48.09 0 bottom
JP993  [1X01_SMD_3.25X0.85MM_NO_SILK]  7.5,46.83 0 bottom
JP994  [1X01_SMD_3.25X0.85MM_NO_SILK]  7.5,45.55 0 bottom
JP995  [1X01_SMD_3.25X0.85MM_NO_SILK]  7.5,44.28 0 bottom
JP996  [1X01_SMD_3.25X0.85MM_NO_SILK]  7.5,43.02 0 bottom
JP997  [1X01_SMD_3.25X0.85MM_NO_SILK]  7.5,41.74 0 bottom
JP998  [1X01_SMD_3.25X0.85MM_NO_SILK]  7.5,40.48 0 bottom
JP999  [1X01_SMD_3.25X0.85MM_NO_SILK]  7.5,39.2 0 bottom
JP1000  [1X01_SMD_3.25X0.85MM_NO_SILK]  7.5,37.94 0 bottom
JP1001  [1X01_SMD_3.25X0.85MM_NO_SILK]  7.5,36.66 0 bottom
JP1002  [1X01_SMD_3.25X0.85MM_NO_SILK]  7.5,35.4 0 bottom
JP1003  [1X01_SMD_3.25X0.85MM_NO_SILK]  7.5,34.12 0 bottom
JP1004  [1X01_SMD_3.25X0.85MM_NO_SILK]  7.5,32.85 0 bottom
JP1005  [1X01_SMD_3.25X0.85MM_NO_SILK]  7.5,31.59 0 bottom
JP1006  [1X01_SMD_3.25X0.85MM_NO_SILK]  7.5,30.32 0 bottom
JP1007  [1X01_SMD_3.25X0.85MM_NO_SILK]  7.5,29.05 0 bottom
JP1008  [1X01_SMD_3.25X0.85MM_NO_SILK]  7.5,27.77 0 bottom
JP1009  [1X01_SMD_3.25X0.85MM_NO_SILK]  7.5,26.5 0 bottom
JP1010  [1X01_SMD_3.25X0.85MM_NO_SILK]  7.5,25.23 0 bottom
JP1011  [1X01_SMD_3.25X0.85MM_NO_SILK]  7.5,23.96 0 bottom
JP1012  [1X01_SMD_3.25X0.85MM_NO_SILK]  7.5,22.7 0 bottom
JP1013  [1X01_SMD_3.25X0.85MM_NO_SILK]  7.5,21.43 0 bottom
JP1014  [1X01_SMD_3.25X0.85MM_NO_SILK]  7.5,20.16 0 bottom
JP1015  [1X01_SMD_3.25X0.85MM_NO_SILK]  7.5,18.89 0 bottom
JP1016  [1X01_SMD_3.25X0.85MM_NO_SILK]  7.5,17.61 0 bottom
JP1017  [1X01_SMD_3.25X0.85MM_NO_SILK]  7.5,16.34 0 bottom
JP1018  [1X01_SMD_3.25X0.85MM_NO_SILK]  7.5,15.07 0 bottom
JP1019  [1X01_SMD_3.25X0.85MM_NO_SILK]  7.5,13.8 0 bottom
JP1020  [1X01_SMD_3.25X0.85MM_NO_SILK]  7.5,12.54 0 bottom
JP1021  [1X01_SMD_3.25X0.85MM_NO_SILK]  62.5,87.47 0 bottom
JP1022  [1X01_SMD_3.25X0.85MM_NO_SILK]  62.5,86.19 0 bottom
JP1023  [1X01_SMD_3.25X0.85MM_NO_SILK]  62.5,84.92 0 bottom
JP1024  [1X01_SMD_3.25X0.85MM_NO_SILK]  62.5,83.66 0 bottom
JP1025  [1X01_SMD_3.25X0.85MM_NO_SILK]  62.5,82.39 0 bottom
JP1026  [1X01_SMD_3.25X0.85MM_NO_SILK]  62.5,81.11 0 bottom
JP1027  [1X01_SMD_3.25X0.85MM_NO_SILK]  62.5,79.84 0 bottom
JP1028  [1X01_SMD_3.25X0.85MM_NO_SILK]  62.5,78.58 0 bottom
JP1029  [1X01_SMD_3.25X0.85MM_NO_SILK]  62.5,77.31 0 bottom
JP1030  [1X01_SMD_3.25X0.85MM_NO_SILK]  62.5,76.03 0 bottom
JP1031  [1X01_SMD_3.25X0.85MM_NO_SILK]  62.5,74.77 0 bottom
JP1032  [1X01_SMD_3.25X0.85MM_NO_SILK]  62.5,73.5 0 bottom
JP1033  [1X01_SMD_3.25X0.85MM_NO_SILK]  62.5,72.22 0 bottom
JP1034  [1X01_SMD_3.25X0.85MM_NO_SILK]  62.5,70.95 0 bottom
JP1035  [1X01_SMD_3.25X0.85MM_NO_SILK]  62.5,69.69 0 bottom
JP1036  [1X01_SMD_3.25X0.85MM_NO_SILK]  62.5,68.42 0 bottom
JP1037  [1X01_SMD_3.25X0.85MM_NO_SILK]  62.5,67.14 0 bottom
JP1038  [1X01_SMD_3.25X0.85MM_NO_SILK]  62.5,65.88 0 bottom
JP1039  [1X01_SMD_3.25X0.85MM_NO_SILK]  62.5,64.61 0 bottom
JP1040  [1X01_SMD_3.25X0.85MM_NO_SILK]  62.5,63.34 0 bottom
JP1041  [1X01_SMD_3.25X0.85MM_NO_SILK]  62.5,62.06 0 bottom
JP1042  [1X01_SMD_3.25X0.85MM_NO_SILK]  62.5,60.8 0 bottom
JP1043  [1X01_SMD_3.25X0.85MM_NO_SILK]  62.5,59.52 0 bottom
JP1044  [1X01_SMD_3.25X0.85MM_NO_SILK]  62.5,58.26 0 bottom
JP1045  [1X01_SMD_3.25X0.85MM_NO_SILK]  62.5,56.98 0 bottom
JP1046  [1X01_SMD_3.25X0.85MM_NO_SILK]  62.5,55.72 0 bottom
JP1047  [1X01_SMD_3.25X0.85MM_NO_SILK]  62.5,54.45 0 bottom
JP1048  [1X01_SMD_3.25X0.85MM_NO_SILK]  62.5,53.17 0 bottom
JP1049  [1X01_SMD_3.25X0.85MM_NO_SILK]  62.5,51.91 0 bottom
JP1050  [1X01_SMD_3.25X0.85MM_NO_SILK]  62.5,50.63 0 bottom
JP1051  [1X01_SMD_3.25X0.85MM_NO_SILK]  62.5,49.37 0 bottom
JP1052  [1X01_SMD_3.25X0.85MM_NO_SILK]  62.5,48.09 0 bottom
JP1053  [1X01_SMD_3.25X0.85MM_NO_SILK]  62.5,46.83 0 bottom
JP1054  [1X01_SMD_3.25X0.85MM_NO_SILK]  62.5,45.55 0 bottom
JP1055  [1X01_SMD_3.25X0.85MM_NO_SILK]  62.5,44.28 0 bottom
JP1056  [1X01_SMD_3.25X0.85MM_NO_SILK]  62.5,43.02 0 bottom
JP1057  [1X01_SMD_3.25X0.85MM_NO_SILK]  62.5,41.74 0 bottom
JP1058  [1X01_SMD_3.25X0.85MM_NO_SILK]  62.5,40.48 0 bottom
JP1059  [1X01_SMD_3.25X0.85MM_NO_SILK]  62.5,39.2 0 bottom
JP1060  [1X01_SMD_3.25X0.85MM_NO_SILK]  62.5,37.94 0 bottom
JP1061  [1X01_SMD_3.25X0.85MM_NO_SILK]  62.5,36.66 0 bottom
JP1062  [1X01_SMD_3.25X0.85MM_NO_SILK]  62.5,35.4 0 bottom
JP1063  [1X01_SMD_3.25X0.85MM_NO_SILK]  62.5,34.12 0 bottom
JP1064  [1X01_SMD_3.25X0.85MM_NO_SILK]  62.5,32.85 0 bottom
JP1065  [1X01_SMD_3.25X0.85MM_NO_SILK]  62.5,31.59 0 bottom
JP1066  [1X01_SMD_3.25X0.85MM_NO_SILK]  62.5,30.32 0 bottom
JP1067  [1X01_SMD_3.25X0.85MM_NO_SILK]  62.5,29.05 0 bottom
JP1068  [1X01_SMD_3.25X0.85MM_NO_SILK]  62.5,27.77 0 bottom
JP1069  [1X01_SMD_3.25X0.85MM_NO_SILK]  62.5,26.5 0 bottom
JP1070  [1X01_SMD_3.25X0.85MM_NO_SILK]  62.5,25.23 0 bottom
JP1071  [1X01_SMD_3.25X0.85MM_NO_SILK]  62.5,23.96 0 bottom
JP1072  [1X01_SMD_3.25X0.85MM_NO_SILK]  62.5,22.7 0 bottom
JP1073  [1X01_SMD_3.25X0.85MM_NO_SILK]  62.5,21.43 0 bottom
JP1074  [1X01_SMD_3.25X0.85MM_NO_SILK]  62.5,20.16 0 bottom
JP1075  [1X01_SMD_3.25X0.85MM_NO_SILK]  62.5,18.89 0 bottom
JP1076  [1X01_SMD_3.25X0.85MM_NO_SILK]  62.5,17.61 0 bottom
JP1077  [1X01_SMD_3.25X0.85MM_NO_SILK]  62.5,16.34 0 bottom
JP1078  [1X01_SMD_3.25X0.85MM_NO_SILK]  62.5,15.07 0 bottom
JP1079  [1X01_SMD_3.25X0.85MM_NO_SILK]  62.5,13.8 0 bottom
JP1080  [1X01_SMD_3.25X0.85MM_NO_SILK]  62.5,12.54 0 bottom
JP1081  [1X01_SMD_3.25X0.85MM_NO_SILK]  67,87.47 0 bottom
JP1082  [1X01_SMD_3.25X0.85MM_NO_SILK]  67,86.19 0 bottom
JP1083  [1X01_SMD_3.25X0.85MM_NO_SILK]  67,84.92 0 bottom
JP1084  [1X01_SMD_3.25X0.85MM_NO_SILK]  67,83.66 0 bottom
JP1085  [1X01_SMD_3.25X0.85MM_NO_SILK]  67,82.39 0 bottom
JP1086  [1X01_SMD_3.25X0.85MM_NO_SILK]  67,81.11 0 bottom
JP1087  [1X01_SMD_3.25X0.85MM_NO_SILK]  67,79.84 0 bottom
JP1088  [1X01_SMD_3.25X0.85MM_NO_SILK]  67,78.58 0 bottom
JP1089  [1X01_SMD_3.25X0.85MM_NO_SILK]  67,77.31 0 bottom
JP1090  [1X01_SMD_3.25X0.85MM_NO_SILK]  67,76.03 0 bottom
JP1091  [1X01_SMD_3.25X0.85MM_NO_SILK]  67,74.77 0 bottom
JP1092  [1X01_SMD_3.25X0.85MM_NO_SILK]  67,73.5 0 bottom
JP1093  [1X01_SMD_3.25X0.85MM_NO_SILK]  67,72.22 0 bottom
JP1094  [1X01_SMD_3.25X0.85MM_NO_SILK]  67,70.95 0 bottom
JP1095  [1X01_SMD_3.25X0.85MM_NO_SILK]  67,69.69 0 bottom
JP1096  [1X01_SMD_3.25X0.85MM_NO_SILK]  67,68.42 0 bottom
JP1097  [1X01_SMD_3.25X0.85MM_NO_SILK]  67,67.14 0 bottom
JP1098  [1X01_SMD_3.25X0.85MM_NO_SILK]  67,65.88 0 bottom
JP1099  [1X01_SMD_3.25X0.85MM_NO_SILK]  67,64.61 0 bottom
JP1100  [1X01_SMD_3.25X0.85MM_NO_SILK]  67,63.34 0 bottom
JP1101  [1X01_SMD_3.25X0.85MM_NO_SILK]  67,62.06 0 bottom
JP1102  [1X01_SMD_3.25X0.85MM_NO_SILK]  67,60.8 0 bottom
JP1103  [1X01_SMD_3.25X0.85MM_NO_SILK]  67,59.52 0 bottom
JP1104  [1X01_SMD_3.25X0.85MM_NO_SILK]  67,58.26 0 bottom
JP1105  [1X01_SMD_3.25X0.85MM_NO_SILK]  67,56.98 0 bottom
JP1106  [1X01_SMD_3.25X0.85MM_NO_SILK]  67,55.72 0 bottom
JP1107  [1X01_SMD_3.25X0.85MM_NO_SILK]  67,54.45 0 bottom
JP1108  [1X01_SMD_3.25X0.85MM_NO_SILK]  67,53.17 0 bottom
JP1109  [1X01_SMD_3.25X0.85MM_NO_SILK]  67,51.91 0 bottom
JP1110  [1X01_SMD_3.25X0.85MM_NO_SILK]  67,50.63 0 bottom
JP1111  [1X01_SMD_3.25X0.85MM_NO_SILK]  67,49.37 0 bottom
JP1112  [1X01_SMD_3.25X0.85MM_NO_SILK]  67,48.09 0 bottom
JP1113  [1X01_SMD_3.25X0.85MM_NO_SILK]  67,46.83 0 bottom
JP1114  [1X01_SMD_3.25X0.85MM_NO_SILK]  67,45.55 0 bottom
JP1115  [1X01_SMD_3.25X0.85MM_NO_SILK]  67,44.28 0 bottom
JP1116  [1X01_SMD_3.25X0.85MM_NO_SILK]  67,43.02 0 bottom
JP1117  [1X01_SMD_3.25X0.85MM_NO_SILK]  67,41.74 0 bottom
JP1118  [1X01_SMD_3.25X0.85MM_NO_SILK]  67,40.48 0 bottom
JP1119  [1X01_SMD_3.25X0.85MM_NO_SILK]  67,39.2 0 bottom
JP1120  [1X01_SMD_3.25X0.85MM_NO_SILK]  67,37.94 0 bottom
JP1121  [1X01_SMD_3.25X0.85MM_NO_SILK]  67,36.66 0 bottom
JP1122  [1X01_SMD_3.25X0.85MM_NO_SILK]  67,35.4 0 bottom
JP1123  [1X01_SMD_3.25X0.85MM_NO_SILK]  67,34.12 0 bottom
JP1124  [1X01_SMD_3.25X0.85MM_NO_SILK]  67,32.85 0 bottom
JP1125  [1X01_SMD_3.25X0.85MM_NO_SILK]  67,31.59 0 bottom
JP1126  [1X01_SMD_3.25X0.85MM_NO_SILK]  67,30.32 0 bottom
JP1127  [1X01_SMD_3.25X0.85MM_NO_SILK]  67,29.05 0 bottom
JP1128  [1X01_SMD_3.25X0.85MM_NO_SILK]  67,27.77 0 bottom
JP1129  [1X01_SMD_3.25X0.85MM_NO_SILK]  67,26.5 0 bottom
JP1130  [1X01_SMD_3.25X0.85MM_NO_SILK]  67,25.23 0 bottom
JP1131  [1X01_SMD_3.25X0.85MM_NO_SILK]  67,23.96 0 bottom
JP1132  [1X01_SMD_3.25X0.85MM_NO_SILK]  67,22.7 0 bottom
JP1133  [1X01_SMD_3.25X0.85MM_NO_SILK]  67,21.43 0 bottom
JP1134  [1X01_SMD_3.25X0.85MM_NO_SILK]  67,20.16 0 bottom
JP1135  [1X01_SMD_3.25X0.85MM_NO_SILK]  67,18.89 0 bottom
JP1136  [1X01_SMD_3.25X0.85MM_NO_SILK]  67,17.61 0 bottom
JP1137  [1X01_SMD_3.25X0.85MM_NO_SILK]  67,16.34 0 bottom
JP1138  [1X01_SMD_3.25X0.85MM_NO_SILK]  67,15.07 0 bottom
JP1139  [1X01_SMD_3.25X0.85MM_NO_SILK]  67,13.8 0 bottom
JP1140  [1X01_SMD_3.25X0.85MM_NO_SILK]  67,12.54 0 bottom
JP1141  [1X01_SMD_3.25X0.85MM_NO_SILK]  16.59,97 270 bottom
JP1142  [1X01_SMD_3.25X0.85MM_NO_SILK]  17.86,97 270 bottom
JP1143  [1X01_SMD_3.25X0.85MM_NO_SILK]  19.12,97 270 bottom
JP1144  [1X01_SMD_3.25X0.85MM_NO_SILK]  20.39,97 270 bottom
JP1145  [1X01_SMD_3.25X0.85MM_NO_SILK]  21.66,97 270 bottom
JP1146  [1X01_SMD_3.25X0.85MM_NO_SILK]  22.93,97 270 bottom
JP1147  [1X01_SMD_3.25X0.85MM_NO_SILK]  24.2,97 270 bottom
JP1148  [1X01_SMD_3.25X0.85MM_NO_SILK]  25.48,97 270 bottom
JP1149  [1X01_SMD_3.25X0.85MM_NO_SILK]  26.75,97 270 bottom
JP1150  [1X01_SMD_3.25X0.85MM_NO_SILK]  28.02,97 270 bottom
JP1151  [1X01_SMD_3.25X0.85MM_NO_SILK]  29.29,97 270 bottom
JP1152  [1X01_SMD_3.25X0.85MM_NO_SILK]  30.55,97 270 bottom
JP1153  [1X01_SMD_3.25X0.85MM_NO_SILK]  31.82,97 270 bottom
JP1154  [1X01_SMD_3.25X0.85MM_NO_SILK]  33.09,97 270 bottom
JP1155  [1X01_SMD_3.25X0.85MM_NO_SILK]  34.37,97 270 bottom
JP1156  [1X01_SMD_3.25X0.85MM_NO_SILK]  35.63,97 270 bottom
JP1157  [1X01_SMD_3.25X0.85MM_NO_SILK]  36.91,97 270 bottom
JP1158  [1X01_SMD_3.25X0.85MM_NO_SILK]  38.17,97 270 bottom
JP1159  [1X01_SMD_3.25X0.85MM_NO_SILK]  39.45,97 270 bottom
JP1160  [1X01_SMD_3.25X0.85MM_NO_SILK]  40.72,97 270 bottom
JP1161  [1X01_SMD_3.25X0.85MM_NO_SILK]  41.98,97 270 bottom
JP1162  [1X01_SMD_3.25X0.85MM_NO_SILK]  43.26,97 270 bottom
JP1163  [1X01_SMD_3.25X0.85MM_NO_SILK]  44.52,97 270 bottom
JP1164  [1X01_SMD_3.25X0.85MM_NO_SILK]  45.8,97 270 bottom
JP1165  [1X01_SMD_3.25X0.85MM_NO_SILK]  47.06,97 270 bottom
JP1166  [1X01_SMD_3.25X0.85MM_NO_SILK]  48.34,97 270 bottom
JP1167  [1X01_SMD_3.25X0.85MM_NO_SILK]  49.6,97 270 bottom
JP1168  [1X01_SMD_3.25X0.85MM_NO_SILK]  50.88,97 270 bottom
JP1169  [1X01_SMD_3.25X0.85MM_NO_SILK]  52.15,97 270 bottom
JP1170  [1X01_SMD_3.25X0.85MM_NO_SILK]  53.41,97 270 bottom
JP1171  [1X01_SMD_3.25X0.85MM_NO_SILK]  16.59,3 270 bottom
JP1172  [1X01_SMD_3.25X0.85MM_NO_SILK]  17.86,3 270 bottom
JP1173  [1X01_SMD_3.25X0.85MM_NO_SILK]  19.12,3 270 bottom
JP1174  [1X01_SMD_3.25X0.85MM_NO_SILK]  20.39,3 270 bottom
JP1175  [1X01_SMD_3.25X0.85MM_NO_SILK]  21.66,3 270 bottom
JP1176  [1X01_SMD_3.25X0.85MM_NO_SILK]  22.93,3 270 bottom
JP1177  [1X01_SMD_3.25X0.85MM_NO_SILK]  24.2,3 270 bottom
JP1178  [1X01_SMD_3.25X0.85MM_NO_SILK]  25.48,3 270 bottom
JP1179  [1X01_SMD_3.25X0.85MM_NO_SILK]  26.75,3 270 bottom
JP1180  [1X01_SMD_3.25X0.85MM_NO_SILK]  28.02,3 270 bottom
JP1181  [1X01_SMD_3.25X0.85MM_NO_SILK]  29.29,3 270 bottom
JP1182  [1X01_SMD_3.25X0.85MM_NO_SILK]  30.55,3 270 bottom
JP1183  [1X01_SMD_3.25X0.85MM_NO_SILK]  31.82,3 270 bottom
JP1184  [1X01_SMD_3.25X0.85MM_NO_SILK]  33.09,3 270 bottom
JP1185  [1X01_SMD_3.25X0.85MM_NO_SILK]  34.37,3 270 bottom
JP1186  [1X01_SMD_3.25X0.85MM_NO_SILK]  35.63,3 270 bottom
JP1187  [1X01_SMD_3.25X0.85MM_NO_SILK]  36.91,3 270 bottom
JP1188  [1X01_SMD_3.25X0.85MM_NO_SILK]  38.17,3 270 bottom
JP1189  [1X01_SMD_3.25X0.85MM_NO_SILK]  39.45,3 270 bottom
JP1190  [1X01_SMD_3.25X0.85MM_NO_SILK]  40.72,3 270 bottom
JP1191  [1X01_SMD_3.25X0.85MM_NO_SILK]  41.98,3 270 bottom
JP1192  [1X01_SMD_3.25X0.85MM_NO_SILK]  43.26,3 270 bottom
JP1193  [1X01_SMD_3.25X0.85MM_NO_SILK]  44.52,3 270 bottom
JP1194  [1X01_SMD_3.25X0.85MM_NO_SILK]  45.8,3 270 bottom
JP1195  [1X01_SMD_3.25X0.85MM_NO_SILK]  47.06,3 270 bottom
JP1196  [1X01_SMD_3.25X0.85MM_NO_SILK]  48.34,3 270 bottom
JP1197  [1X01_SMD_3.25X0.85MM_NO_SILK]  49.6,3 270 bottom
JP1198  [1X01_SMD_3.25X0.85MM_NO_SILK]  50.88,3 270 bottom
JP1199  [1X01_SMD_3.25X0.85MM_NO_SILK]  52.15,3 270 bottom
JP1200  [1X01_SMD_3.25X0.85MM_NO_SILK]  53.41,3 270 bottom